# Altium project PA_Channel_PREAMP.PrjPcb
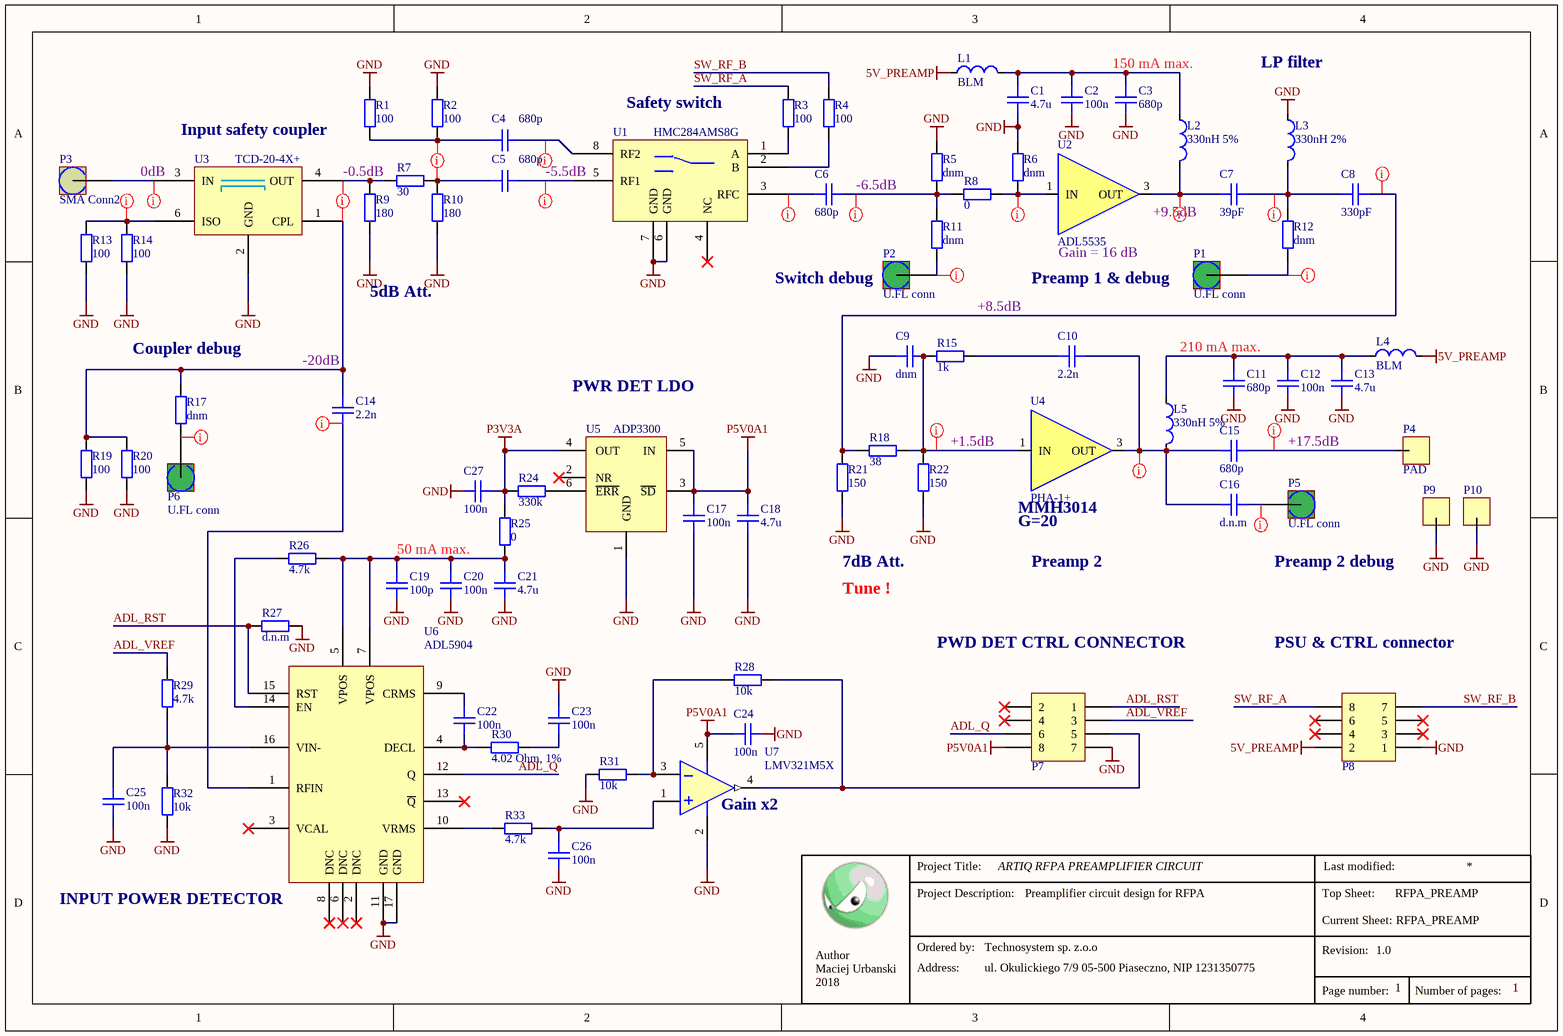
[diagram p0: RFPA_PREAMP.SchDoc]
1 sheet, 80 parts. Net scope: global (net labels, ports and power ports of the same name join across sheets).
Board file: RFPA_PREAMP.PcbDoc

## Sheet RFPA_PREAMP.SchDoc: ARTIQ RFPA PREAMPLIFIER CIRCUIT
size A4; Author: Maciej Urbanski; CompanyName: -; Revision: 1.0; SheetNumber: 1; SheetTotal: 1; Comments: Preamplifier circuit design for RFPA; Wersja: 1.0; CustomerInfo: Technosystem sp. z.o.o; CustomerAddress: ul. Okulickiego 7/9 05-500 Piaseczno, NIP 1231350775; CopyrightBy: Maciej Urbanski; CopyrightDate: 2018; TopSheet: RFPA_PREAMP; CurrentSheet: RFPA_PREAMP; ProjectName: RFPA

### Parts
C1  4.7u  [0603_ZE]
C2  100n  [0603_ZE]
C3  680p  [0603_ZE]
C4  680p  [0603_ZE]
C5  680p  [0603_ZE]
C6  680p  [0603_ZE]
C7  39pF  [0603_ZE]
C8  330pF  [0603_ZE]
C9  dnm  [0603_ZE]
C10  2.2n  [0603_ZE]
C11  680p  [0603_ZE]
C12  100n  [0603_ZE]
C13  4.7u  [0603_ZE]
C14  2.2n  [0603_ZE]
C15  680p  [0603_ZE]
C16  d.n.m  [0603_ZE]
C17  100n  [0603_ZE]
C18  4.7u  [0603_ZE]
C19  100p  [0603_ZE]
C20  100n  [0603_ZE]
C21  4.7u  [0603_ZE]
C22  100n  [0603_ZE]
C23  100n  [0603_ZE]
C24  100n  [0603_ZE]
C25  100n  [0603_ZE]
C26  100n  [0603_ZE]
C27  100n  [0603_ZE]
L1  BLM  [0603_IND]
L2  330nH 5%  [0603_IND]
L3  330nH 2%  [0603_IND]
L4  BLM  [0603_IND]
L5  330nH 5%  [0603_IND]
P1  U.FL conn  [HIROSE_U.FL-R-SMT-1(10)]
P2  U.FL conn  [HIROSE_U.FL-R-SMT-1(10)]
P3  SMA Conn2  [CONSMA002-SMD-G]
P4  PAD  [PAD_2x3_rect]
P5  U.FL conn  [HIROSE_U.FL-R-SMT-1(10)]
P6  U.FL conn  [HIROSE_U.FL-R-SMT-1(10)]
P7  HDR2X4  [HDR2X4_SMD]  (value not drawn)
P8  HDR2X4  [HDR2X4_SMD]  (value not drawn)
P9  PAD  [PAD_2x3_rect]  (value not drawn)
P10  PAD  [PAD_2x3_rect]  (value not drawn)
R1  100  [0603_ZE]
R2  100  [0603_ZE]
R3  100  [0603_ZE]
R4  100  [0603_ZE]
R5  dnm  [0603_ZE]
R6  dnm  [0603_ZE]
R7  30  [0603_ZE]
R8  0  [0603_ZE]
R9  180  [0603_ZE]
R10  180  [0603_ZE]
R11  dnm  [0603_ZE]
R12  dnm  [0603_ZE]
R13  100  [0603_ZE]
R14  100  [0603_ZE]
R15  1k  [0603_ZE]
R17  dnm  [0603_ZE]
R18  38  [0603_ZE]
R19  100  [0603_ZE]
R20  100  [0603_ZE]
R21  150  [0603_ZE]
R22  150  [0603_ZE]
R24  330k  [0603_ZE]
R25  0  [0603_ZE]
R26  4.7k  [0402_ZE]
R27  d.n.m  [0402_ZE]
R28  10k  [0603_ZE]
R29  4.7k  [chip_r_1206]
R30  4.02 Ohm, 1%  [0603_ZE]
R31  10k  [0603_ZE]
R32  10k  [0603_ZE]
R33  4.7k  [0603_ZE]
U1  HMC284AMS8G  [MSOP8 PPAD]
U2  ADL5535  [SOT89]
U3  TCD-20-4X+  [XFMR_MINI-CIRCUITS_DB1627]
U4  PHA-1+  [SOT89]
U5  ADP3300  [SOT26]
U6  ADL5904  [QFN50P300X300X80-17N-S125]
U7  LMV321M5X  [SOT23-5_N]

### Nets
5V_PREAMP: L1.1 L4.2 P8.2
GND: C1.1 C2.1 C3.1 C9.2 C11.1 C12.1 C13.1 C17.1 C18.1 C19.1 C20.1 C21.1 C23.2 C24.1 C25.1 C26.1 C27.2 L3.1 P1.2(GND) P2.2(GND) P3.0(GND) P5.2(GND) P6.2(GND) P7.7 P8.1 P9.1 P10.1 R1.2 R2.1 R5.1 R6.1 R9.2 R10.2 R13.1 R14.1 R19.1 R20.1 R21.2 R22.2 R27.1 R31.2 R32.2 U1.6(GND) U1.7(GND) U1.9(PPAD) U2.2(GND) U3.2(GND) U4.2(GND) U5.1(GND) U6.11(GND) U6.17(GND) U7.2(V-)
P3V3A: C27.1 R24.2 R25.1 U5.4(OUT)
P5V0A1: C17.2 C18.2 C24.2 P7.8 U5.3(~{SD}) U5.5(IN) U7.5(V+)
ADL_Q: P7.6 U6.12(Q)
ADL_RST: P7.1 R27.2 U6.15(RST)
ADL_VREF: P7.3 R29.1
SW_RF_A: P8.8 R3.2
SW_RF_B: P8.7 R4.2
NetC1_2: C1.2 C2.2 C3.2 L1.2 L2.1
NetC4_1: C4.1 R1.1 R2.2
NetC4_2: C4.2 U1.8(RF2)
NetC5_1: C5.1 R7.2 R10.1
NetC5_2: C5.2 U1.5(RF1)
NetC6_1: C6.1 U1.3(RFC)
NetC6_2: C6.2 R5.2 R8.1 R11.2
NetC7_1: C7.1 L2.2 U2.3(OUT)
NetC7_2: C7.2 C8.1 L3.2 R12.2
NetC8_2: C8.2 R18.1 R21.1
NetC9_1: C9.1 R15.1 R18.2 R22.1 U4.1(IN)
NetC10_1: C10.1 C15.1 C16.2 L5.2 U4.3(OUT)
NetC10_2: C10.2 R15.2
NetC11_2: C11.2 C12.2 C13.2 L4.1 L5.1
NetC14_1: C14.1 U6.1(RFIN)
NetC14_2: C14.2 R17.2 R19.2 R20.2 U3.1(CPL)
NetC15_2: C15.2 P4.1
NetC16_1: C16.1 P5.1
NetC19_2: C19.2 C20.2 C21.2 R25.2 R26.1 U6.5(VPOS) U6.7(VPOS)
NetC22_1: C22.1 R30.2 U6.4(DECL)
NetC22_2: C22.2 U6.9(CRMS)
NetC23_1: C23.1 R30.1
NetC25_2: C25.2 R29.2 R32.1 U6.16(VIN-)
NetC26_2: C26.2 R33.1 U7.1(IN+)
NetP1_1: P1.1 R12.1
NetP2_1: P2.1 R11.1
NetP3_1: P3.1 U3.3(IN)
NetP6_1: P6.1 R17.1
NetP7_5: P7.5 R28.1 U7.4(OUT)
NetR3_1: R3.1 U1.1(A)
NetR4_1: R4.1 U1.2(B)
NetR6_2: R6.2 R8.2 U2.1(IN)
NetR7_1: R7.1 R9.1 U3.4(OUT)
NetR13_2: R13.2 R14.2 U3.6(ISO)
NetR24_1: R24.1 U5.6(~{ERR})
NetR26_2: R26.2 U6.14(EN)
NetR28_2: R28.2 R31.1 U7.3(IN-)
NetR33_2: R33.2 U6.10(VRMS)

Not connected (* = marked no-connect by the designer): P7 2* 4*; P8 3* 4* 5* 6*; U1 4(NC)*; U5 2(NR)*; U6 2(DNC)* 3(VCAL)* 6(DNC)* 8(DNC)* 13(~{Q})*

### Layout directives
net class 50_Ohm: NetC4_1, NetC4_2, NetC5_1, NetC5_2, NetC6_1, NetC6_2, NetC7_1, NetC7_2, NetC8_2, NetC9_1, NetC10_1, NetC14_1, NetC14_2, NetC15_2, NetC16_1, NetP1_1, NetP2_1, NetP3_1, NetP6_1, NetR6_2, NetR7_1, NetR13_2

### Notes on the sheet
- Safety switch
- (near C3) 150 mA max.
- (near L3) LP filter
- (near U3) 0dB
- (near R1) Input safety coupler
- -0.5dB
- -5.5dB
- (near C6) -6.5dB
- +9.5dB
- 5dB Att.
- (near P2) Switch debug
- +8.5dB
- (near P1) Preamp 1 & debug
- Gain = 16 dB
- (near R17) Coupler debug
- (near C14) -20dB
- (near C11) 210 mA max.
- PWR DET LDO
- +1.5dB
- +17.5dB
- (near U4) MMH3014
- 50 mA max.
- 7dB Att.
- G=20
- Preamp 2
- Preamp 2 debug
- Tune !
- PWD DET CTRL CONNECTOR
- PSU & CTRL connector
- (near U7) Gain x2
- INPUT POWER DETECTOR
- Project Title:
- Project Description:
- Top Sheet:
- Current Sheet:
- Last modified:
- Author
- Maciej Urbanski
- Ordered by:
- Address:
- Revision:
- Page number:
- Number of pages:

### Library data of the parts
C1 C13 C18 C21 = C: Capacitor; Manufacturer: Murata; Manufacturer Part Number: GRM188R61C475KAAJD; Generic: yes; Remarks: Tolerance 10%; Value: 4.7u; Mounting type: SMT; Package: 0603; Supplier 1: Farnell; Supplier 2: Mouser; Supplier 3: Digikey; Supplier Part Number 1: 2611924RL; Supplier Part Number 2: 81-GRM188R61C475KAJD; Supplier Part Number 3: 490-10481-1-ND
C2 C12 = C: Capacitor; Manufacturer: Multicomp; Manufacturer Part Number: MC0603B104K160CT; Generic: yes; Remarks: Tolerance 10%; Value: 100n; Mounting type: SMT; Package: 0603; Supplier 1: Farnell; Supplier 2: -; Supplier 3: -; Supplier Part Number 1: 1759016RL; Supplier Part Number 2: -; Supplier Part Number 3: -
C3-C6 C11 C15 C16 = C: Capacitor; Manufacturer: Multicomp; Manufacturer Part Number: MCMT18N681F500CT; Remarks: Tolerance 1%; Generic: yes; Mounting type: SMT; Package: 0603; Supplier 1: Farnell; Supplier 2: -; Supplier 3: -; Supplier Part Number 1: 1856154RL; Supplier Part Number 2: -; Supplier Part Number 3: -
  C3-C6 C11 C15: Value: 680p
  C16: Value: d.n.m
C7 = C: Capacitor; Manufacturer: AVX; Manufacturer Part Number: 06031A390FAT2A; Remarks: Tolerance 1%; Generic: yes; Value: 39pF; Mounting type: SMT; Package: 0603; Supplier 1: Farnell; Supplier 2: Mouser; Supplier 3: Digikey; Supplier Part Number 1: 2332564RL; Supplier Part Number 2: 581-06031A390FAT2A; Supplier Part Number 3: 478-5773-1-ND
C8 = C: Capacitor; Manufacturer: AVX; Manufacturer Part Number: 06035A331FAT2A; Remarks: Tolerance 1%; Generic: yes; Value: 330pF; Mounting type: SMT; Package: 0603; Supplier 1: Farnell; Supplier 2: Mouser; Supplier 3: Digikey; Supplier Part Number 1: 2332616RL; Supplier Part Number 2: 581-06035A331FAT2A; Supplier Part Number 3: 478-6031-1-ND
C9 = C: Capacitor; Generic: yes; Value: dnm; Manufacturer: -; Mounting type: SMT; Manufacturer Part Number: -; Package: 0603; Remarks: -; Supplier 1: -; Supplier 2: -; Supplier 3: -; Supplier Part Number 1: -; Supplier Part Number 2: -; Supplier Part Number 3: -
C10 C14 = C: Capacitor; Manufacturer: Murata; Manufacturer Part Number: GRM155R61H104KE19D; Generic: yes; Value: 2.2n; Mounting type: SMT; Package: 0402; Remarks: -; Supplier 1: Mouser; Supplier 2: Digi Key; Supplier 3: Farnell; Supplier Part Number 1: 81-GRM155R61H104KE9D; Supplier Part Number 2: 490-11917-1-ND; Supplier Part Number 3: 2218856
C17 C19 C20 C22-C27 = C: Capacitor; Manufacturer: Multicomp; Manufacturer Part Number: MC0603B104K160CT; Remarks: Tolerance 10%; Generic: yes; Mounting type: SMT; Package: 0603; Supplier 1: Farnell; Supplier 2: -; Supplier 3: -; Supplier Part Number 1: 1759016RL; Supplier Part Number 2: -; Supplier Part Number 3: -
  C17 C20 C22-C27: Value: 100n
  C19: Value: 100p
L1 L4 = Inductor: Manufacturer: Murata; Manufacturer Part Number: BLM18HE102SN1D; Generic: no; Value: BLM; Mounting type: SMT; Package: 0603; Remarks: -; Supplier 1: Farnell; Supplier 2: Mouser; Supplier 3: Digikey; Supplier Part Number 1: 2443236; Supplier Part Number 2: 81-BLM18HE102SN1D; Supplier Part Number 3: 490-5215-1-ND
L2 L5 = Inductor: Manufacturer: Murata; Manufacturer Part Number: LQW18CNR33J00D; Generic: no; Remarks: Tolerance 5%; Value: 330nH 5%; Mounting type: SMT; Package: 0603; Supplier 1: Farnell; Supplier 2: Mouser; Supplier 3: Digikey; Supplier Part Number 1: 2219329; Supplier Part Number 2: 81-LQW18CNR33J00D; Supplier Part Number 3: 490-10772-1-ND
L3 = Inductor: Manufacturer: Coilcraft; Manufacturer Part Number: 0603LS-331XGLB; Generic: no; Remarks: Tolerance 2%; Value: 330nH 2%; Mounting type: SMT; Package: 0603; Supplier 1: Farnell; Supplier 2: Mouser; Supplier 3: -; Supplier Part Number 1: 2286254; Supplier Part Number 2: 994-0603LS-331XGLB; Supplier Part Number 3: -
P1 P2 P5 P6 = U.FL socket: Hiroso U.FL series RF connector fmax 6GHz; Manufacturer: Hirose; Manufacturer Part Number: U.FL-R-SMT(01); Generic: yes; Remarks: Can be replaced with any u.FL connector; Mounting type: SMT; Value: -; Package: u.FL SMD; Supplier 1: Farnell; Supplier 2: Mouser; Supplier 3: Digikey; Supplier Part Number 1: 1688077; Supplier Part Number 2: 798-U.FL-R-SMT-110; Supplier Part Number 3: H11891CT-ND
P3 = SMA Conn2: SMA Connector 142-0711-301; Manufacturer: Linx Technologies; Generic: no; Remarks: Can be replaced with Multicomp 19-49-2-TGG; Manufacturer Part Number: CONSMA002-SMD-G; Mounting type: SMT; Package: SMA SMD angled; Supplier 1: Mouser; Supplier 2: Farnell; Supplier 3: -; Supplier Part Number 1: 712-CONSMA002-SMD-G; Supplier Part Number 2: 1169635; Supplier Part Number 3: -; Value: -
P4 P9 P10 = PAD: Generic: no; Remarks: PCB PAD; Value: -; Manufacturer: -; Manufacturer Part Number: -; Mounting type: -; Package: -; Supplier 1: -; Supplier 2: -; Supplier 3: -; Supplier Part Number 1: -; Supplier Part Number 2: -; Supplier Part Number 3: -
P7 P8 = HDR2X4: Header, 4-Pin, Dual Row; Generic: yes; Remarks: ordinary goldpin socket; Value: -; Manufacturer: -; Manufacturer Part Number: -; Mounting type: SMT; Package: 2x4 pin SMD; Supplier 1: TME; Supplier 2: -; Supplier 3: -; Supplier Part Number 1: ZL264-8DG; Supplier Part Number 2: -; Supplier Part Number 3: -
R1-R4 R7 R9 R10 R13-R15 R18-R22 R24 R26 R28 R29 R31-R33 = R2: Resistor; Generic: yes; Remarks: Tolerance 1%; Manufacturer: -; Mounting type: SMT; Manufacturer Part Number: -; Supplier 1: -; Supplier 2: -; Supplier 3: -; Supplier Part Number 1: -; Supplier Part Number 2: -; Supplier Part Number 3: -
  R1-R4 R13 R14 R19 R20: Value: 100; Package: 0603
  R7: Value: 30; Package: 0603
  R9 R10: Value: 180; Package: 0603
  R15: Value: 1k; Package: 0603
  R18: Value: 38; Package: 0603
  R21 R22: Value: 150; Package: 0603
  R24: Value: 330k; Package: 0603
  R26: Value: 4.7k; Package: 0402
  R28 R31 R32: Value: 10k; Package: 0603
  R29: Value: 4.7k; Package: 1206
  R33: Value: 4.7k; Package: 0603
R5 R6 R11 R12 R17 R27 = R2: Resistor; Generic: yes; Manufacturer: -; Mounting type: SMT; Manufacturer Part Number: -; Remarks: -; Supplier 1: -; Supplier 2: -; Supplier 3: -; Supplier Part Number 1: -; Supplier Part Number 2: -; Supplier Part Number 3: -
  R5 R6 R11 R12 R17: Value: dnm; Package: 0603
  R27: Value: d.n.m; Package: 0402
R8 R25 = R2: Resistor; Generic: yes; Remarks: Debug resitor, to be placed in release version; Value: 0; Manufacturer: -; Mounting type: SMT; Manufacturer Part Number: -; Package: 0603; Supplier 1: -; Supplier 2: -; Supplier 3: -; Supplier Part Number 1: -; Supplier Part Number 2: -; Supplier Part Number 3: -
R30 = R2: Resistor; Generic: yes; Remarks: Value must be 4.02 Ohm, 1%; Value: 4.02 Ohm, 1%; Manufacturer: -; Mounting type: SMT; Manufacturer Part Number: -; Package: 0603; Supplier 1: -; Supplier 2: -; Supplier 3: -; Supplier Part Number 1: -; Supplier Part Number 2: -; Supplier Part Number 3: -
U1 = HMC284AMS8G: SPDT Non-Reflective Switch  DC - 3.5 GHz; Manufacturer: Analog Devices; Generic: no; Manufacturer Part Number: HMC284AMS8G; Value: HMC284AMS8G; Package: MSOP-8; Supplier 1: Mouser; Supplier 2: Digi Key; Supplier 3: Farnell; Supplier Part Number 1: 584-HMC284AMS8G; Supplier Part Number 2: 1127-1317-1-ND; Supplier Part Number 3: 2456612; Mounting type: SMT; Remarks: -
U2 = HMC639ST89: High IP3, Low Noise RF Amplifier, 0.2-4.0 GHz; Manufacturer: Analog Devices; Manufacturer Part Number: ADL5535ARKZ-R7; Gain: 16.3 @ 200 MHz; NF: 1.8dB; P1dB: 22dBm; IP3: 38dBm; Generic: no; Remarks: Can be replaced with ADL5536, but 7dB attenuator needs to be changed to 11dB; Value: -; Mounting type: SMT; Package: SOT89; Supplier 1: Farnell; Supplier 2: Mouser; Supplier 3: Digikey; Supplier Part Number 1: 2377137; Supplier Part Number 2: 584-ADL5535ARKZ-R7; Supplier Part Number 3: ADL5535ARKZ-R7CT-ND
U3 = TCD-20-4X+: SMD Directional Coupler, 20dB; Manufacturer: Mini Circuits; Generic: no; Value: -; Manufacturer Part Number: TCD-20-4X+; Mounting type: SMT; Package: DB1627; Remarks: -; Supplier 1: Municom; Supplier 2: -; Supplier 3: -; Supplier Part Number 1: TCD-20-4X+; Supplier Part Number 2: -; Supplier Part Number 3: -
U4 = HMC639ST89: High IP3, Low Noise RF Amplifier, 0.2-4.0 GHz; Manufacturer: MiniCircuits; Gain: 16.3 @ 200 MHz; NF: 1.8dB; P1dB: 22dBm; IP3: 38dBm; Generic: no; Value: -; Manufacturer Part Number: PHA-1+; Mounting type: SMT; Package: SOT89; Remarks: -; Supplier 1: Municom; Supplier 2: -; Supplier 3: -; Supplier Part Number 1: PHA-1+; Supplier Part Number 2: -; Supplier Part Number 3: -
U5 = ADP3300: High Accuracy anyCAP®  50 mA Low Dropout Linear Regulator; Manufacturer: Analog Devices; Manufacturer Part Number: ADP3300ARTZ-3.3RL7; Output voltage: 3.3V; Output current max.: 50mA; Generic: no; Mounting type: SMT; Value: -; Package: SOT-23-6; Remarks: -; Supplier 1: Farnell; Supplier 2: Mouser; Supplier 3: Digikey; Supplier Part Number 1: 1661067RL; Supplier Part Number 2: 584-ADP3300ARTZ3.3R7; Supplier Part Number 3: ADP3300ARTZ3.3RCT-ND
U6 = ADL5904: DC to 6 GHz 45dB TruPwr Detector with Envelope Threshold Detection; Manufacturer: Analog Devices; Manufacturer Part Number: ADL5904ACPZN-R7; Generic: no; Value: -; Mounting type: SMT; Package: QFN-16; Remarks: -; Supplier 1: Mouser; Supplier 2: Digikey; Supplier 3: -; Supplier Part Number 1: 584-ADL5904ACPZN-R7; Supplier Part Number 2: ADL5904ACPZN-R7CT-ND; Supplier Part Number 3: -
U7 = LMV321M5X: Single General Purpose Low voltage Rail to Rail Output Op amp; Manufacturer: TI; Generic: no; Manufacturer part number: LMV321M5X; Value: -; Mounting type: SMT; Package: SOT-23-6; Remarks: -; Supplier 1: Farnell; Supplier 2: Mouser; Supplier 3: Digikey; Supplier Part Number 1: 2764711; Supplier Part Number 2: 926-LMV321M5X/NOPB; Supplier Part Number 3: LMV321M5X/NOPBCT-ND